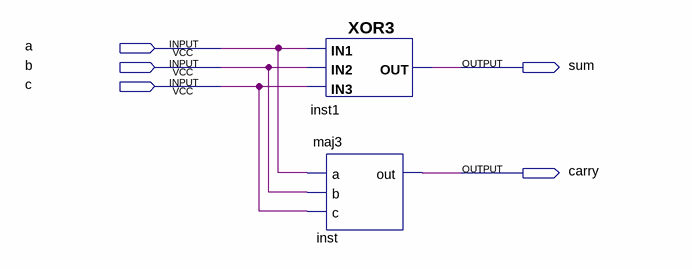
[diagram p0: schematic sheet]
// Quartus schematic full_adder.bdf as structural Verilog: 2 symbols, 5 pins
module full_adder (
  input  a,
  input  b,
  input  c,
  output sum,
  output carry
);

  XOR3 inst1 (.IN3(c), .IN1(a), .IN2(b), .OUT(sum));
  maj3 inst (.a(a), .b(b), .c(c), .out(carry));
endmodule
